# Altium project pca63557.PrjPCB (part 2 of 2)

## Sheet pca63557_sheet4_misc.SchDoc: =BoardTitle
size A4; Organization: Nordic Semiconductor; DocumentNumber: 4; Revision: 0.1.0; SheetNumber: 4; SheetTotal: 4; Author: MAM1; CompanyName: Nordic Semiconductor; DrawnBy: MAM1; DocumentSize: A4; ProjectName: Student related activities
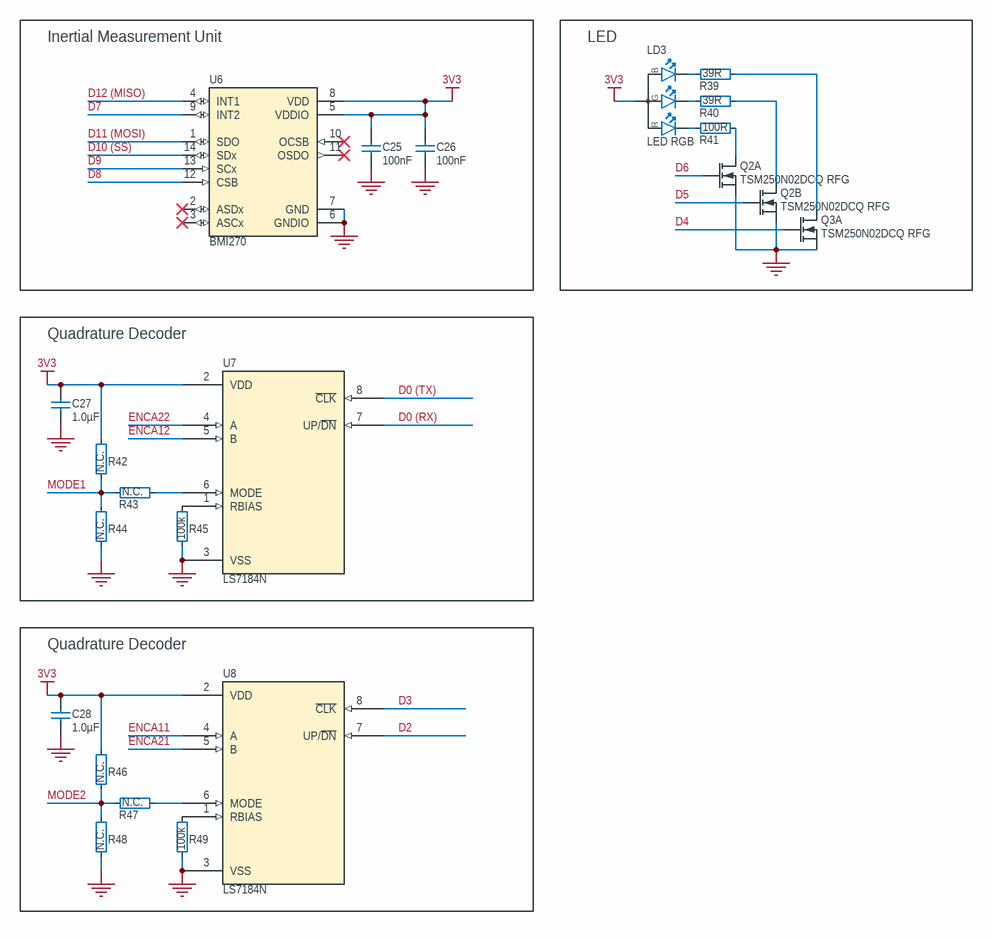
[diagram p3: pca63557_sheet4_misc.SchDoc]

### Parts
C25  100nF  [CAPC1005X04L]
C26  100nF  [CAPC1005X04L]
C27  1.0µF  [CAPC1005X04L]
C28  1.0µF  [CAPC1005X04L]
LD3  LED RGB  [LED_RGB_0606]
Q2  TSM250N02DCQ RFG  [DFN65P200X200X80_HS-6N]  (parts A,B of 2)
Q3  TSM250N02DCQ RFG  [DFN65P200X200X80_HS-6N]  (part A of 2)
R39  39R  [RESC1005X04L]
R40  39R  [RESC1005X04L]
R41  100R  [RESC1005X04L]
R42  N.C.  [RESC1005X04L_NC]
R43  N.C.  [RESC1005X04L_NC]
R44  N.C.  [RESC1005X04L_NC]
R45  100k  [RESC1005X04L]
R46  N.C.  [RESC1005X04L_NC]
R47  N.C.  [RESC1005X04L_NC]
R48  N.C.  [RESC1005X04L_NC]
R49  100k  [RESC1005X04L]
U6  BMI270  [BMI270]
U7  LS7184N  [LS7184N]
U8  LS7184N  [LS7184N]

### Blocks framed on the sheet
Inertial Measurement Unit: C25 C26 U6
LED: LD3 Q2 Q3 R39-R41
Quadrature Decoder: C27 R42-R45 U7
Quadrature Decoder: C28 R46-R49 U8

### Nets
3V3: C25.2 C26.2 C27.2 C28.2 LD3.4(A) R42.2 R46.2 U6.5(VDDIO) U6.8(VDD) U7.2(VDD) U8.2(VDD)
GND: C25.1 C26.1 C27.1 C28.1 Q2.1(S1) Q2.4(S2) Q3.1(S1) R44.1 R45.1 R48.1 R49.1 U6.6(GNDIO) U6.7(GND) U7.3(VSS) U8.3(VSS)
D0 (RX): U7.7(UP/~{DN})
D0 (TX): U7.8(~{CLK})
D2: U8.7(UP/~{DN})
D3: U8.8(~{CLK})
D4: Q3.2(G1)
D5: Q2.5(G2)
D6: Q2.2(G1)
D7: U6.9(INT2)
D8: U6.12(CSB)
D9: U6.13(SCx)
D10 (SS): U6.14(SDx)
D11 (MOSI): U6.1(SDO)
D12 (MISO): U6.4(INT1)
ENCA11: U8.4(A)
ENCA12: U7.5(B)
ENCA21: U8.5(B)
ENCA22: U7.4(A)
MODE1: R42.1 R43.1 R44.2
MODE2: R46.1 R47.1 R48.2
NetLD3_1: LD3.1(C_RED) R41.1
NetLD3_2: LD3.2(C_GREEN) R40.1
NetLD3_3: LD3.3(C_BLUE) R39.1
NetQ2_3: Q2.3(D2) R40.2
NetQ2_6: Q2.6(D1) R41.2
NetQ3_6: Q3.6(D1) R39.2
NetR43_2: R43.2 U7.6(MODE)
NetR45_2: R45.2 U7.1(RBIAS)
NetR47_2: R47.2 U8.6(MODE)
NetR49_2: R49.2 U8.1(RBIAS)

Not connected (* = marked no-connect by the designer): U6 2(ASDx)* 3(ASCx)* 10(OCSB)* 11(OSDO)*

### Notes on the sheet
- Title
- Size
- Date:
- File:
- A4
- PCB Assembly Number
- Sheet         of
- Drawn By:
- Revision
- Classification:
- (in symbol LTST-C19HE1WT) B; G; R

### Library data of the parts
C25 C26 = C0402-100n: Capacitor, X7R, ±10%; Manufacturer: N.A.; Part number IPS: 00000005296; Part number NEMS: 100200184; Component Status: Active; Pad Count: 2; Note: 16V; Artikkelnr Noca: 20039200; Part Number: C0402-100n; PartId: 100200184; Component Class: Capacitors; Author: rsk; Manufacturer Part Number: N.A.; ComponentLink1URL: N.A.; ComponentLink1Description: Datasheet; ComponentLink2URL: N.A.; ComponentLink2Description: Supplier link; HelpURL: N.A.; Footprint Doc: 0402; LatestRevisionDate: 2009-11-23; Published: 2009-05-08; Value: 100nF; Supplier 1: N.A.; Supplier Part Number 1: N.A.; Supplier 2: N.A.; Supplier Part Number 2: N.A.; Part number Norautron: N.A.
C27 C28 = C0402-1µ0-10V-X5R: Capacitor, Ceramic, X5R, ±10%, 10V; Manufacturer: N.A.; Part number NEMS: 100200482; Component Status: Active; Pad Count: 2; Part Number: C0402-1µ0-10V-X5R; PartId: 100200482; Component Class: Capacitors; Author: rubr; Manufacturer Part Number: N.A.; ComponentLink1URL: N.A.; ComponentLink1Description: Datasheet; ComponentLink2URL: N.A.; ComponentLink2Description: Supplier link; HelpURL: N.A.; Footprint Doc: 0402; LatestRevisionDate: 2021-07-22; Published: 2021-07-22; Value: 1.0µF; Note: 10V; Supplier 1: N.A.; Supplier Part Number 1: N.A.; Supplier 2: N.A.; Supplier Part Number 2: N.A.; Artikkelnr Noca: N.A.; Part number IPS: N.A.; Part number Norautron: N.A.
LD3 = LTST-C19HE1WT: RGB LED 1.60 mm x 1.60 mm SMD; Manufacturer: Lite-On Inc; Part number IPS: 00000007798; Part number NEMS: 101400093; Component Status: Active; Pad Count: 4; Note: N.A.; Part Number: LTST-C19HE1WT; PartId: 101400093; Component Class: Optoelectronics; Author: rsk; Manufacturer Part Number: LTST-C19HE1WT; ComponentLink1URL: N.A.; ComponentLink1Description: Datasheet; ComponentLink2URL: N.A.; ComponentLink2Description: Supplier link; HelpURL: http://optoelectronics.liteon.com/upload/download/DS22-2008-0044/S_110_LTST-C19HE1WT.pdf; Footprint Doc: LED_RGB_0606; LatestRevisionDate: 2016-09-23; Published: 2016-09-23; Value: LED RGB; Supplier 1: Digi-Key; Supplier Part Number 1: 160-2162-1-ND; Supplier 2: Mouser; Supplier Part Number 2: 859-LTST-C19HE1WT; Artikkelnr Noca: N.A.; Part number Norautron: N.A.
Q2 Q3 = TSM250N02DCQ RFG: Dual N Ch MOFET, 5.8A, 55mOhm max, 620mW; Manufacturer: Taiwan Semiconductor; Part number IPS: 00000001703; Part number NEMS: 101300161; Component Status: Active; Pad Count: 6; Note: N.A.; Part Number: TSM250N02DCQ RFG; PartId: 101300161; Component Class: Semiconductors; Author: rsk; Manufacturer Part Number: TSM250N02DCQ RFG; ComponentLink1URL: https://www.taiwansemi.com/products/datasheet/TSM250N02D_B15.pdf; ComponentLink1Description: Datasheet; ComponentLink2URL: N.A.; ComponentLink2Description: Supplier link; HelpURL: https://www.taiwansemi.com/products/datasheet/TSM250N02D_B15.pdf; Footprint Doc: VDFN-6; LatestRevisionDate: 2018-10-31; Published: 2018-10-31; Value: TSM250N02DCQ RFG; Supplier 1: Digi-Key; Supplier Part Number 1: TSM250N02DCQRFGCT-ND; Supplier 2: N.A.; Supplier Part Number 2: N.A.; Artikkelnr Noca: N.A.; Part number Norautron: N.A.
R39 R40 = R0402-39R: Resistor, ±1%, 0.063W; Manufacturer: N.A.; Part number IPS: 00000000821; Part number NEMS: 100100138; Component Status: Active; Pad Count: 2; Note: Chip Res 1%; Artikkelnr Noca: 27049039; Part Number: R0402-39R; PartId: 100100138; Component Class: Resistors; Author: rsk; Manufacturer Part Number: N.A.; ComponentLink1URL: N.A.; ComponentLink1Description: Datasheet; ComponentLink2URL: N.A.; ComponentLink2Description: Supplier link; HelpURL: N.A.; Footprint Doc: 0402; LatestRevisionDate: 2009-11-23; Published: 2009-05-08; Value: 39R; Supplier 1: Farnell; Supplier Part Number 1: 173-8831; Supplier 2: N.A.; Supplier Part Number 2: N.A.; Part number Norautron: N.A.
R41 = R0402-100: Resistor, ±1%, 0.063W; Manufacturer: N.A.; Part number IPS: 00000002811; Part number NEMS: 100100148; Component Status: Active; Pad Count: 2; Note: Chip Res 1%; Artikkelnr Noca: 27049049; Part Number: R0402-100; PartId: 100100148; Component Class: Resistors; Author: rsk; Manufacturer Part Number: N.A.; ComponentLink1URL: N.A.; ComponentLink1Description: Datasheet; ComponentLink2URL: N.A.; ComponentLink2Description: Supplier link; HelpURL: N.A.; Footprint Doc: 0402; LatestRevisionDate: 2009-11-23; Published: 2009-05-08; Value: 100R; Supplier 1: Farnell; Supplier Part Number 1: 173-8837; Supplier 2: N.A.; Supplier Part Number 2: N.A.; Part number Norautron: N.A.
R42-R44 R46-R48 = R0402-N.C.: Not mounted; Manufacturer: N.A.; Part number NEMS: 100100281; Component Status: Active; Pad Count: 2; Note: Chip Res; Assembly: Not mounted; Part Number: R0402-N.C.; PartId: 100100281; Component Class: Resistors; Author: rsk; Manufacturer Part Number: N.A.; ComponentLink1URL: N.A.; ComponentLink1Description: Datasheet; ComponentLink2URL: N.A.; ComponentLink2Description: Supplier link; HelpURL: N.A.; Footprint Doc: 0402; LatestRevisionDate: 2009-05-08; Published: 2009-05-08; Value: N.C.; Supplier 1: N.A.; Supplier Part Number 1: N.A.; Supplier 2: N.A.; Supplier Part Number 2: N.A.; Artikkelnr Noca: N.A.; Part number IPS: N.A.; Part number Norautron: N.A.
R45 R49 = R0402-100k: Resistor, ±1%, 0.063W; Manufacturer: N.A.; Part number IPS: 00000003667; Part number NEMS: 100100239; Component Status: Active; Pad Count: 2; Note: Chip Res 1%; Artikkelnr Noca: 27049121; Part Number: R0402-100k; PartId: 100100239; Component Class: Resistors; Author: rsk; Manufacturer Part Number: N.A.; ComponentLink1URL: N.A.; ComponentLink1Description: Datasheet; ComponentLink2URL: N.A.; ComponentLink2Description: Supplier link; HelpURL: N.A.; Footprint Doc: 0402; LatestRevisionDate: 2009-11-23; Published: 2009-05-08; Value: 100k; Supplier 1: Farnell; Supplier Part Number 1: 173-8877; Supplier 2: N.A.; Supplier Part Number 2: N.A.; Part number Norautron: N.A.
U6 = BMI270: 6-axis, smart, low-power, inertial measurement unit; Manufacturer: Bosch; Part number NEMS: 101900620; Component Status: Active; Pad Count: 14; Note: N.A.; Part Number: BMI270; PartId: 101900620; Component Class: Misc_ICs; Author: rsk; Manufacturer Part Number: BMI270; ComponentLink1URL: https://www.bosch-sensortec.com/media/boschsensortec/downloads/datasheets/bst-bmi270-ds000.pdf; ComponentLink1Description: Datasheet; ComponentLink2URL: https://www.bosch-sensortec.com/products/motion-sensors/imus/bmi270.html; ComponentLink2Description: Supplier link; HelpURL: https://www.bosch-sensortec.com/media/boschsensortec/downloads/datasheets/bst-bmi270-ds000.pdf; Footprint Doc: LGA-14; LatestRevisionDate: 2021-08-03; Published: 2020-07-07; Value: BMI270; Supplier 1: Digi-Key; Supplier Part Number 1: 828-1091-1-ND; Supplier 2: Mouser; Supplier Part Number 2: 262-BMI270; Artikkelnr Noca: N.A.; Part number IPS: N.A.; Part number Norautron: N.A.
U7 U8 = LS7184N: QUADRATURE CLOCK CONVERTER; Manufacturer: LSI/CSI; Manufacturer Part Number: LS7184N-S; Component Status: Active; Note: N.A.; Pad Count: 8; Part Number: LS7184N; Component Class: Misc_ICs; Author: mam1; ComponentLink1URL: https://lsicsi.com/datasheets/LS7183N_LS7184N.pdf; ComponentLink1Description: Datasheet; ComponentLink2URL: https://www.digikey.no/en/products/detail/lsi-csi/LS7184N-S/12760890; ComponentLink2Description: Supplier link; HelpURL: N.A.; LatestRevisionDate: 2022-06-21; Published: 2022-06-21; Value: LS7184N; Supplier 1: Digi-Key; Supplier Part Number 1: 2808-LS7184N-S-ND; Supplier 2: N.A.; Supplier Part Number 2: N.A.; Artikkelnr Noca: N.A.; Part number IPS: N.A.; Part number Norautron: N.A.; Footprint Doc: LS7184N

## Nets that join several sheets
3V3: pca63557_sheet1_connectors (P13.1 P13.7 P14.1 P14.7), pca63557_sheet2_power_supply (5 pins), pca63557_sheet3_motor (6 pins), pca63557_sheet4_misc (11 pins)
9V: pca63557_sheet2_power_supply (9 pins), pca63557_sheet3_motor (6 pins)
GND: pca63557_sheet1_connectors (12 pins), pca63557_sheet2_power_supply (29 pins), pca63557_sheet3_motor (22 pins), pca63557_sheet4_misc (15 pins)
SH_VIN3-5V: pca63557_sheet1_connectors (P1.9 P2.9), pca63557_sheet2_power_supply (R1.2)
SH_VIO_REF: pca63557_sheet1_connectors (P1.12 P2.12), pca63557_sheet2_power_supply (R4.2)
A0: pca63557_sheet1_connectors (P5.1 P6.1), pca63557_sheet3_motor (R20.1 R31.1)
A1: pca63557_sheet1_connectors (P5.2 P6.2), pca63557_sheet3_motor (U4.15)
A2: pca63557_sheet1_connectors (P5.3 P6.3), pca63557_sheet3_motor (U4.16)
A3: pca63557_sheet1_connectors (P5.4 P6.4), pca63557_sheet3_motor (U4.1)
A4: pca63557_sheet1_connectors (P5.5 P6.5), pca63557_sheet3_motor (U4.2)
A5: pca63557_sheet1_connectors (P5.6 P6.6), pca63557_sheet3_motor (R23.1 R34.1)
AREF: pca63557_sheet1_connectors (P9.8 P10.8), pca63557_sheet3_motor (U5.16)
D0 (RX): pca63557_sheet1_connectors (P7.1 P8.1), pca63557_sheet4_misc (U7.7)
D0 (TX): pca63557_sheet1_connectors (P7.2 P8.2), pca63557_sheet4_misc (U7.8)
D2: pca63557_sheet1_connectors (P7.3 P8.3), pca63557_sheet4_misc (U8.7)
D3: pca63557_sheet1_connectors (P7.4 P8.4), pca63557_sheet4_misc (U8.8)
D4: pca63557_sheet1_connectors (P7.5 P8.5), pca63557_sheet4_misc (Q3.2)
D5: pca63557_sheet1_connectors (P7.6 P8.6), pca63557_sheet4_misc (Q2.5)
D6: pca63557_sheet1_connectors (P7.7 P8.7), pca63557_sheet4_misc (Q2.2)
D7: pca63557_sheet1_connectors (P7.8 P8.8), pca63557_sheet4_misc (U6.9)
D8: pca63557_sheet1_connectors (P9.1 P10.1), pca63557_sheet4_misc (U6.12)
D9: pca63557_sheet1_connectors (P9.2 P10.2), pca63557_sheet4_misc (U6.13)
D10 (SS): pca63557_sheet1_connectors (P9.3 P10.3), pca63557_sheet4_misc (U6.14)
D11 (MOSI): pca63557_sheet1_connectors (P9.4 P10.4), pca63557_sheet4_misc (U6.1)
D12 (MISO): pca63557_sheet1_connectors (P9.5 P10.5), pca63557_sheet4_misc (U6.4)
D13 (SCK): pca63557_sheet1_connectors (P9.6 P10.6), pca63557_sheet3_motor (U5.15)
ENCA11: pca63557_sheet1_connectors (P13.5), pca63557_sheet4_misc (U8.4)
ENCA12: pca63557_sheet1_connectors (P14.5), pca63557_sheet4_misc (U7.5)
ENCA21: pca63557_sheet1_connectors (P13.6), pca63557_sheet4_misc (U8.5)
ENCA22: pca63557_sheet1_connectors (P14.6), pca63557_sheet4_misc (U7.4)
OUTA11: pca63557_sheet1_connectors (P13.3), pca63557_sheet3_motor (U4.3)
OUTA12: pca63557_sheet1_connectors (P14.3), pca63557_sheet3_motor (U5.3)
OUTA21: pca63557_sheet1_connectors (P13.4), pca63557_sheet3_motor (U4.5)
OUTA22: pca63557_sheet1_connectors (P14.4), pca63557_sheet3_motor (U5.5)
OUTB11: pca63557_sheet1_connectors (P13.9), pca63557_sheet3_motor (U4.10)
OUTB12: pca63557_sheet1_connectors (P14.9), pca63557_sheet3_motor (U5.10)
OUTB21: pca63557_sheet1_connectors (P13.10), pca63557_sheet3_motor (U4.8)
OUTB22: pca63557_sheet1_connectors (P14.10), pca63557_sheet3_motor (U5.8)
SCL: pca63557_sheet1_connectors (P9.10 P10.10), pca63557_sheet3_motor (U5.2)
SDA: pca63557_sheet1_connectors (P9.9 P10.9), pca63557_sheet3_motor (U5.1)